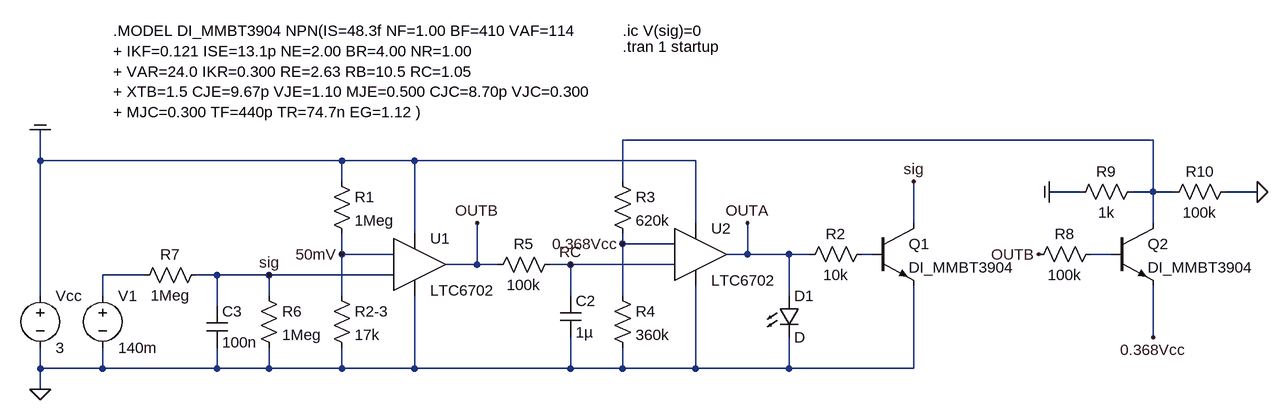
[diagram p0: schematic Windchill01.asc]
Windchill01.asc, the LTspice schematic file:
Version 4
SHEET 1 1952 680
WIRE 1360 -48 544 -48
WIRE -352 -16 -352 -64
WIRE 112 -16 -352 -16
WIRE 224 -16 112 -16
WIRE 656 -16 224 -16
WIRE 112 16 112 -16
WIRE 544 16 544 -48
WIRE 1248 32 1200 32
WIRE 1360 32 1360 -48
WIRE 1360 32 1328 32
WIRE 1392 32 1360 32
WIRE 1520 32 1472 32
WIRE 656 80 656 -16
WIRE 992 80 992 16
WIRE 1360 80 1360 32
WIRE 224 96 224 -16
WIRE 544 112 544 96
WIRE 624 112 544 112
WIRE 112 128 112 96
WIRE 192 128 112 128
WIRE 736 128 736 80
WIRE 736 128 704 128
WIRE 800 128 736 128
WIRE 832 128 800 128
WIRE 928 128 912 128
WIRE 1296 128 1264 128
WIRE 320 144 320 80
WIRE 320 144 272 144
WIRE 352 144 320 144
WIRE 464 144 432 144
WIRE 624 144 464 144
WIRE -192 160 -256 160
WIRE -80 160 -112 160
WIRE 0 160 -80 160
WIRE 192 160 0 160
WIRE -352 192 -352 -16
WIRE -256 192 -256 160
WIRE 0 192 0 160
WIRE 112 192 112 128
WIRE 464 192 464 144
WIRE 544 192 544 112
WIRE 800 192 800 128
WIRE -80 208 -80 160
WIRE 1360 256 1360 176
WIRE -352 304 -352 272
WIRE -256 304 -256 272
WIRE -256 304 -352 304
WIRE -80 304 -80 272
WIRE -80 304 -256 304
WIRE 0 304 0 272
WIRE 0 304 -80 304
WIRE 112 304 112 272
WIRE 112 304 0 304
WIRE 224 304 224 192
WIRE 224 304 112 304
WIRE 464 304 464 256
WIRE 464 304 224 304
WIRE 544 304 544 272
WIRE 544 304 464 304
WIRE 656 304 656 176
WIRE 656 304 544 304
WIRE 800 304 800 256
WIRE 800 304 656 304
WIRE 992 304 992 176
WIRE 992 304 800 304
WIRE -352 336 -352 304
FLAG -352 -64 COM
FLAG -352 336 0
FLAG 112 128 50mV
FLAG 544 112 0.368Vcc
FLAG 992 16 sig
FLAG 0 160 sig
FLAG 1360 256 0.368Vcc
FLAG 320 80 OUTB
FLAG 736 80 OUTA
FLAG 1184 128 OUTB
FLAG 464 144 RC
FLAG 1520 32 0
FLAG 1200 32 COM
SYMBOL cap 448 192 R0
SYMATTR InstName C2
SYMATTR Value 1µ
SYMBOL res 96 0 R0
SYMATTR InstName R1
SYMATTR Value 1Meg
SYMBOL res 96 176 R0
SYMATTR InstName R2-3
SYMATTR Value 17k
SYMBOL voltage -352 176 R0
WINDOW 123 0 0 Left 2
WINDOW 39 0 0 Left 2
SYMATTR InstName Vcc
SYMATTR Value 3
SYMBOL res 528 0 R0
SYMATTR InstName R3
SYMATTR Value 620k
SYMBOL res 528 176 R0
SYMATTR InstName R4
SYMATTR Value 360k
SYMBOL res 336 160 R270
WINDOW 0 32 56 VTop 2
WINDOW 3 0 56 VBottom 2
SYMATTR InstName R5
SYMATTR Value 100k
SYMBOL Comparators\\LTC6702 224 144 R0
SYMATTR InstName U1
SYMBOL Comparators\\LTC6702 656 128 R0
SYMATTR InstName U2
SYMBOL Infineon-RFTransistor-SPICE.lib-SM-v02_10-EN\\npn 928 80 R0
SYMATTR InstName Q1
SYMATTR Value DI_MMBT3904
SYMBOL res 816 144 R270
WINDOW 0 32 56 VTop 2
WINDOW 3 0 56 VBottom 2
SYMATTR InstName R2
SYMATTR Value 10k
SYMBOL voltage -256 176 R0
WINDOW 123 0 0 Left 2
WINDOW 39 0 0 Left 2
SYMATTR InstName V1
SYMATTR Value 140m
SYMBOL res -208 176 R270
WINDOW 0 32 56 VTop 2
WINDOW 3 0 56 VBottom 2
SYMATTR InstName R7
SYMATTR Value 1Meg
SYMBOL cap -96 208 R0
SYMATTR InstName C3
SYMATTR Value 100n
SYMBOL res -16 176 R0
SYMATTR InstName R6
SYMATTR Value 1Meg
SYMBOL res 1168 144 R270
WINDOW 0 32 56 VTop 2
WINDOW 3 0 56 VBottom 2
SYMATTR InstName R8
SYMATTR Value 100k
SYMBOL Infineon-RFTransistor-SPICE.lib-SM-v02_10-EN\\npn 1296 80 R0
SYMATTR InstName Q2
SYMATTR Value DI_MMBT3904
SYMBOL res 1232 48 R270
WINDOW 0 32 56 VTop 2
WINDOW 3 0 56 VBottom 2
SYMATTR InstName R9
SYMATTR Value 1k
SYMBOL res 1376 48 R270
WINDOW 0 32 56 VTop 2
WINDOW 3 0 56 VBottom 2
SYMATTR InstName R10
SYMATTR Value 100k
SYMBOL LED 784 192 R0
SYMATTR InstName D1
TEXT 544 -192 Left 2 !.tran 1 startup
TEXT -240 -216 Left 2 !.MODEL DI_MMBT3904 NPN(IS=48.3f NF=1.00 BF=410 VAF=114\n+ IKF=0.121 ISE=13.1p NE=2.00 BR=4.00 NR=1.00\n+ VAR=24.0 IKR=0.300 RE=2.63 RB=10.5 RC=1.05\n+ XTB=1.5 CJE=9.67p VJE=1.10 MJE=0.500 CJC=8.70p VJC=0.300\n+ MJC=0.300 TF=440p TR=74.7n EG=1.12 )
TEXT 544 -216 Left 2 !.ic V(sig)=0

The netlist it stands for:
* Windchill01.asc
C2 RC 0 1µ
R1 COM 50mV 1Meg
R2-3 50mV 0 17k
Vcc COM 0 3
R3 N001 0.368Vcc 620k
R4 0.368Vcc 0 360k
R5 OUTB RC 100k
XU1 sig 50mV COM 0 OUTB LTC6702
XU2 RC 0.368Vcc COM 0 OUTA LTC6702
Q1 sig N002 0 0 DI_MMBT3904
R2 OUTA N002 10k
V1 N004 0 140m
R7 N004 sig 1Meg
C3 sig 0 100n
R6 sig 0 1Meg
R8 OUTB N003 100k
Q2 N001 N003 0.368Vcc 0 DI_MMBT3904
R9 COM N001 1k
R10 N001 0 100k
D1 OUTA 0 D
.model D D
.lib standard.dio
.model NPN NPN
.model PNP PNP
.lib standard.bjt
.tran 1 startup
.MODEL DI_MMBT3904 NPN(IS=48.3f NF=1.00 BF=410 VAF=114
+ IKF=0.121 ISE=13.1p NE=2.00 BR=4.00 NR=1.00
+ VAR=24.0 IKR=0.300 RE=2.63 RB=10.5 RC=1.05
+ XTB=1.5 CJE=9.67p VJE=1.10 MJE=0.500 CJC=8.70p VJC=0.300
+ MJC=0.300 TF=440p TR=74.7n EG=1.12 )
.ic V(sig)=0
.lib LTC3.lib
.backanno
.end